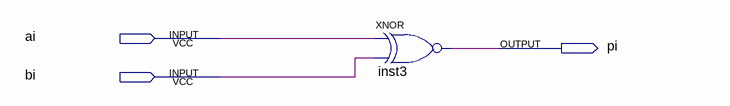
[diagram p0: schematic sheet]
// Quartus schematic borrow_propagate.bdf as structural Verilog: 1 symbols, 3 pins
module borrow_propagate (
  input  ai,
  input  bi,
  output pi
);

  xnor inst3 (pi, ai, bi);
endmodule
